# Altium schematic sheet bmsSlave_cover.SchDoc
size A; SheetNumber: 1; SheetTotal: 5
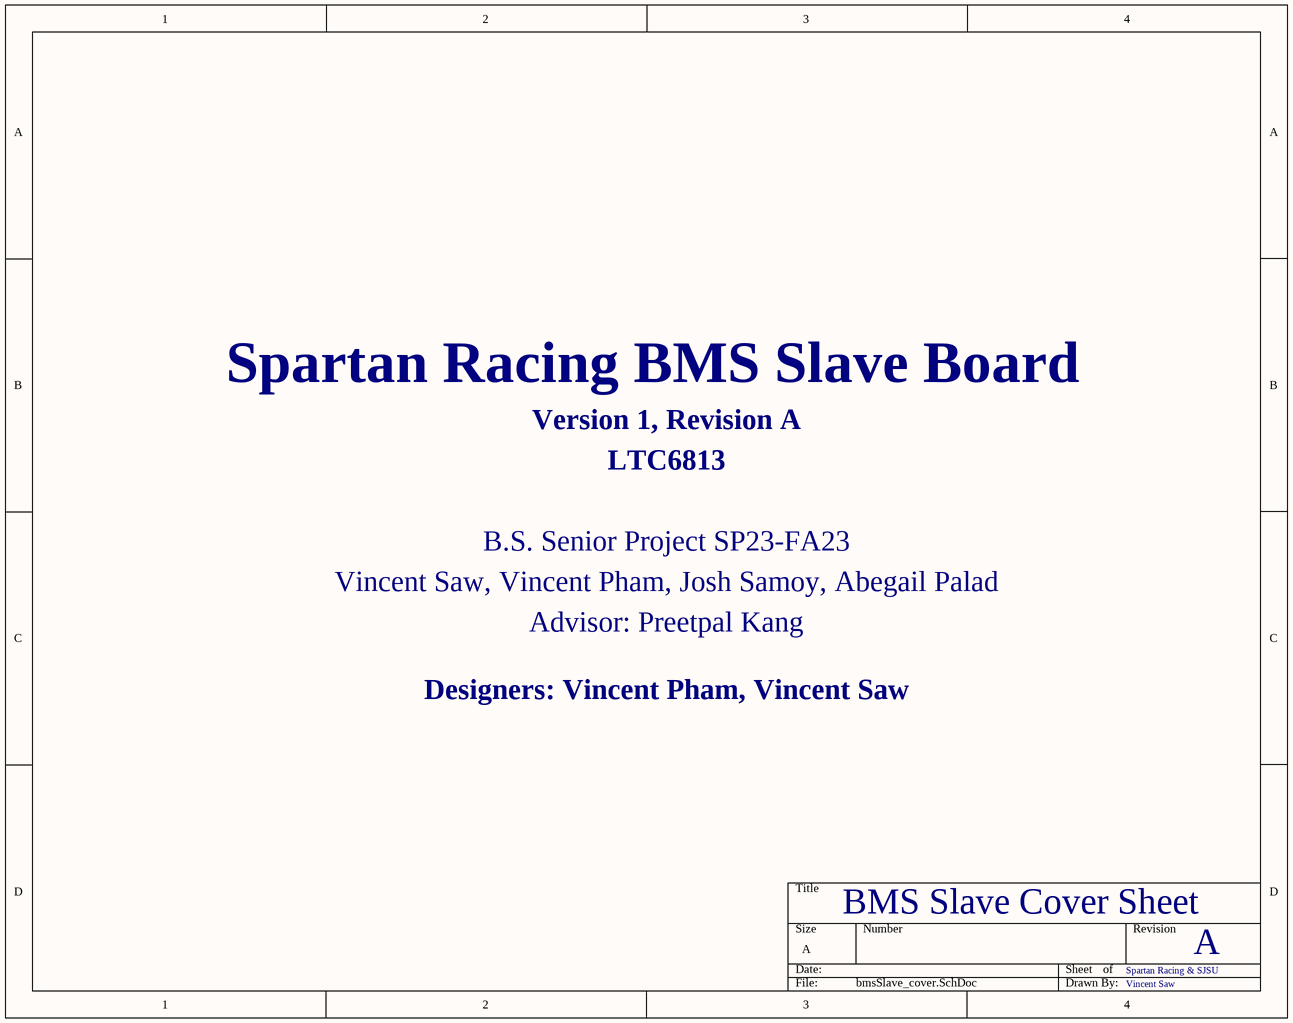
[diagram p0: bmsSlave_cover.SchDoc]

## Notes on the sheet
- Spartan Racing BMS Slave Board
- Version 1, Revision A
- LTC6813
- B.S. Senior Project SP23-FA23
- Vincent Saw, Vincent Pham, Josh Samoy, Abegail Palad
- Advisor: Preetpal Kang
- Designers: Vincent Pham, Vincent Saw
- BMS Slave Cover Sheet
- Spartan Racing & SJSU
- A
- Vincent Saw